# EasyEDA Pro project ProPrj_stmf4+esp32s3转接板_2025-01-29.epro, board PCB1
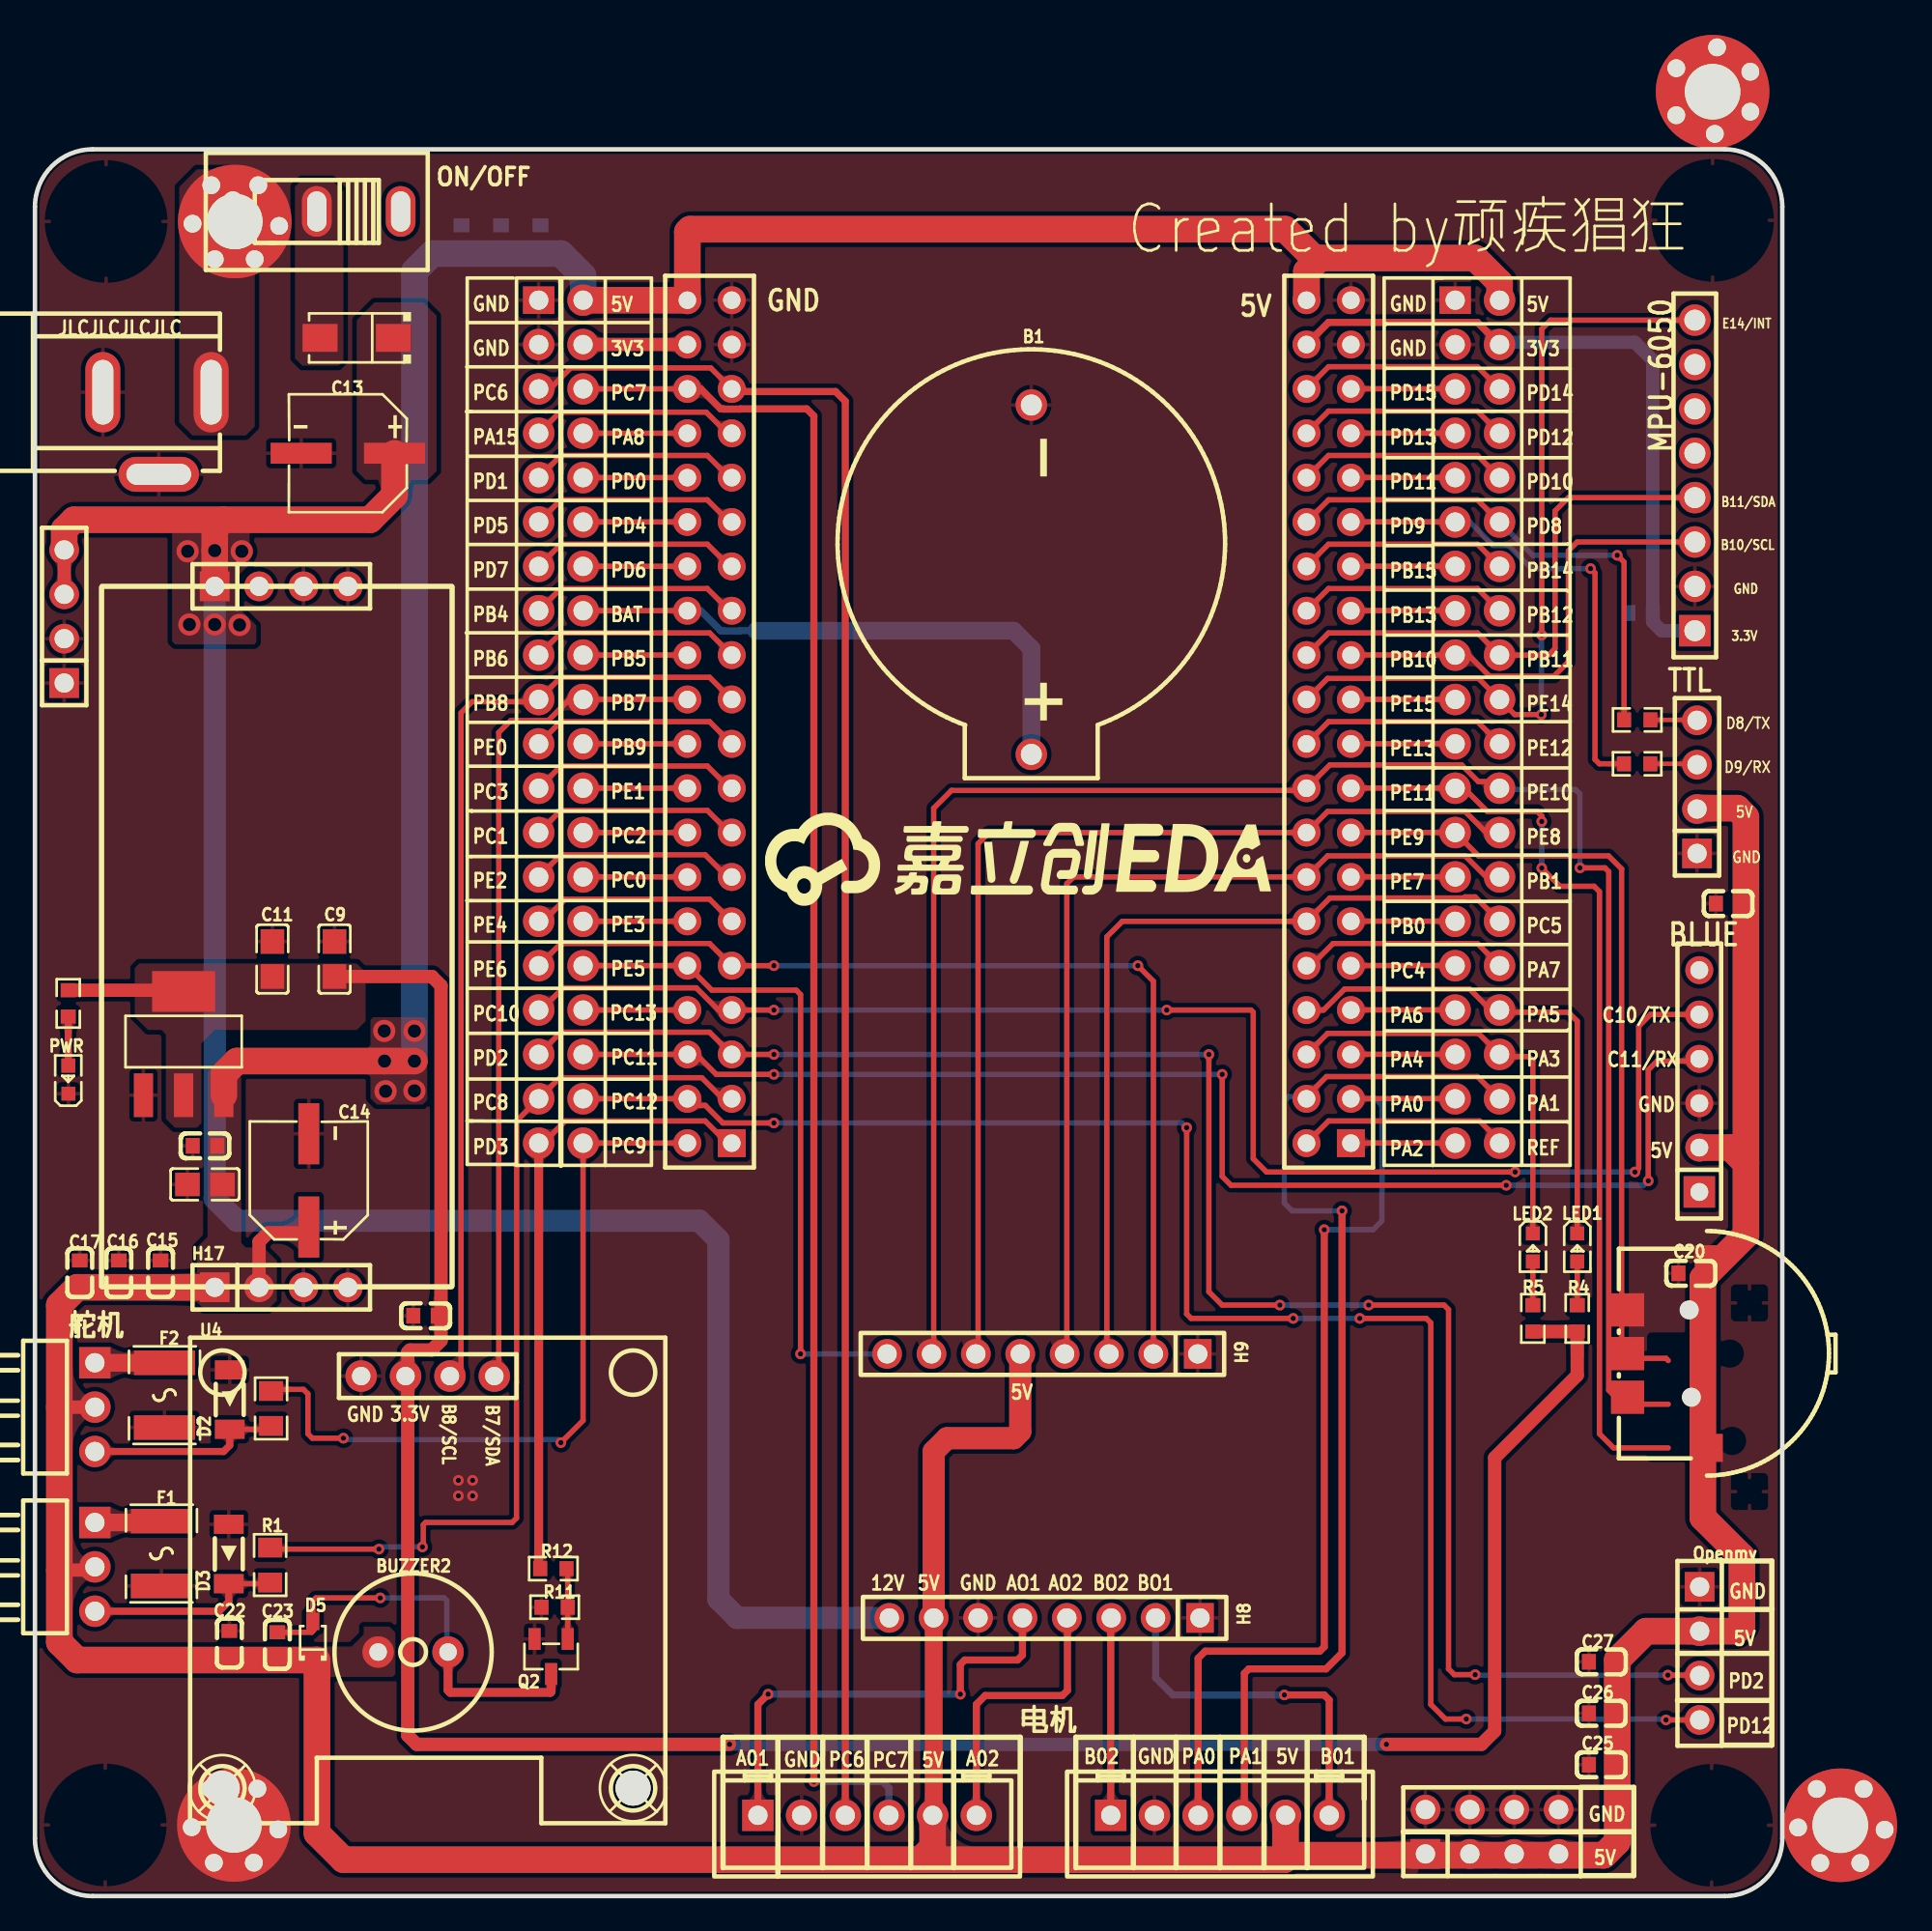
[diagram p2: board, top side]
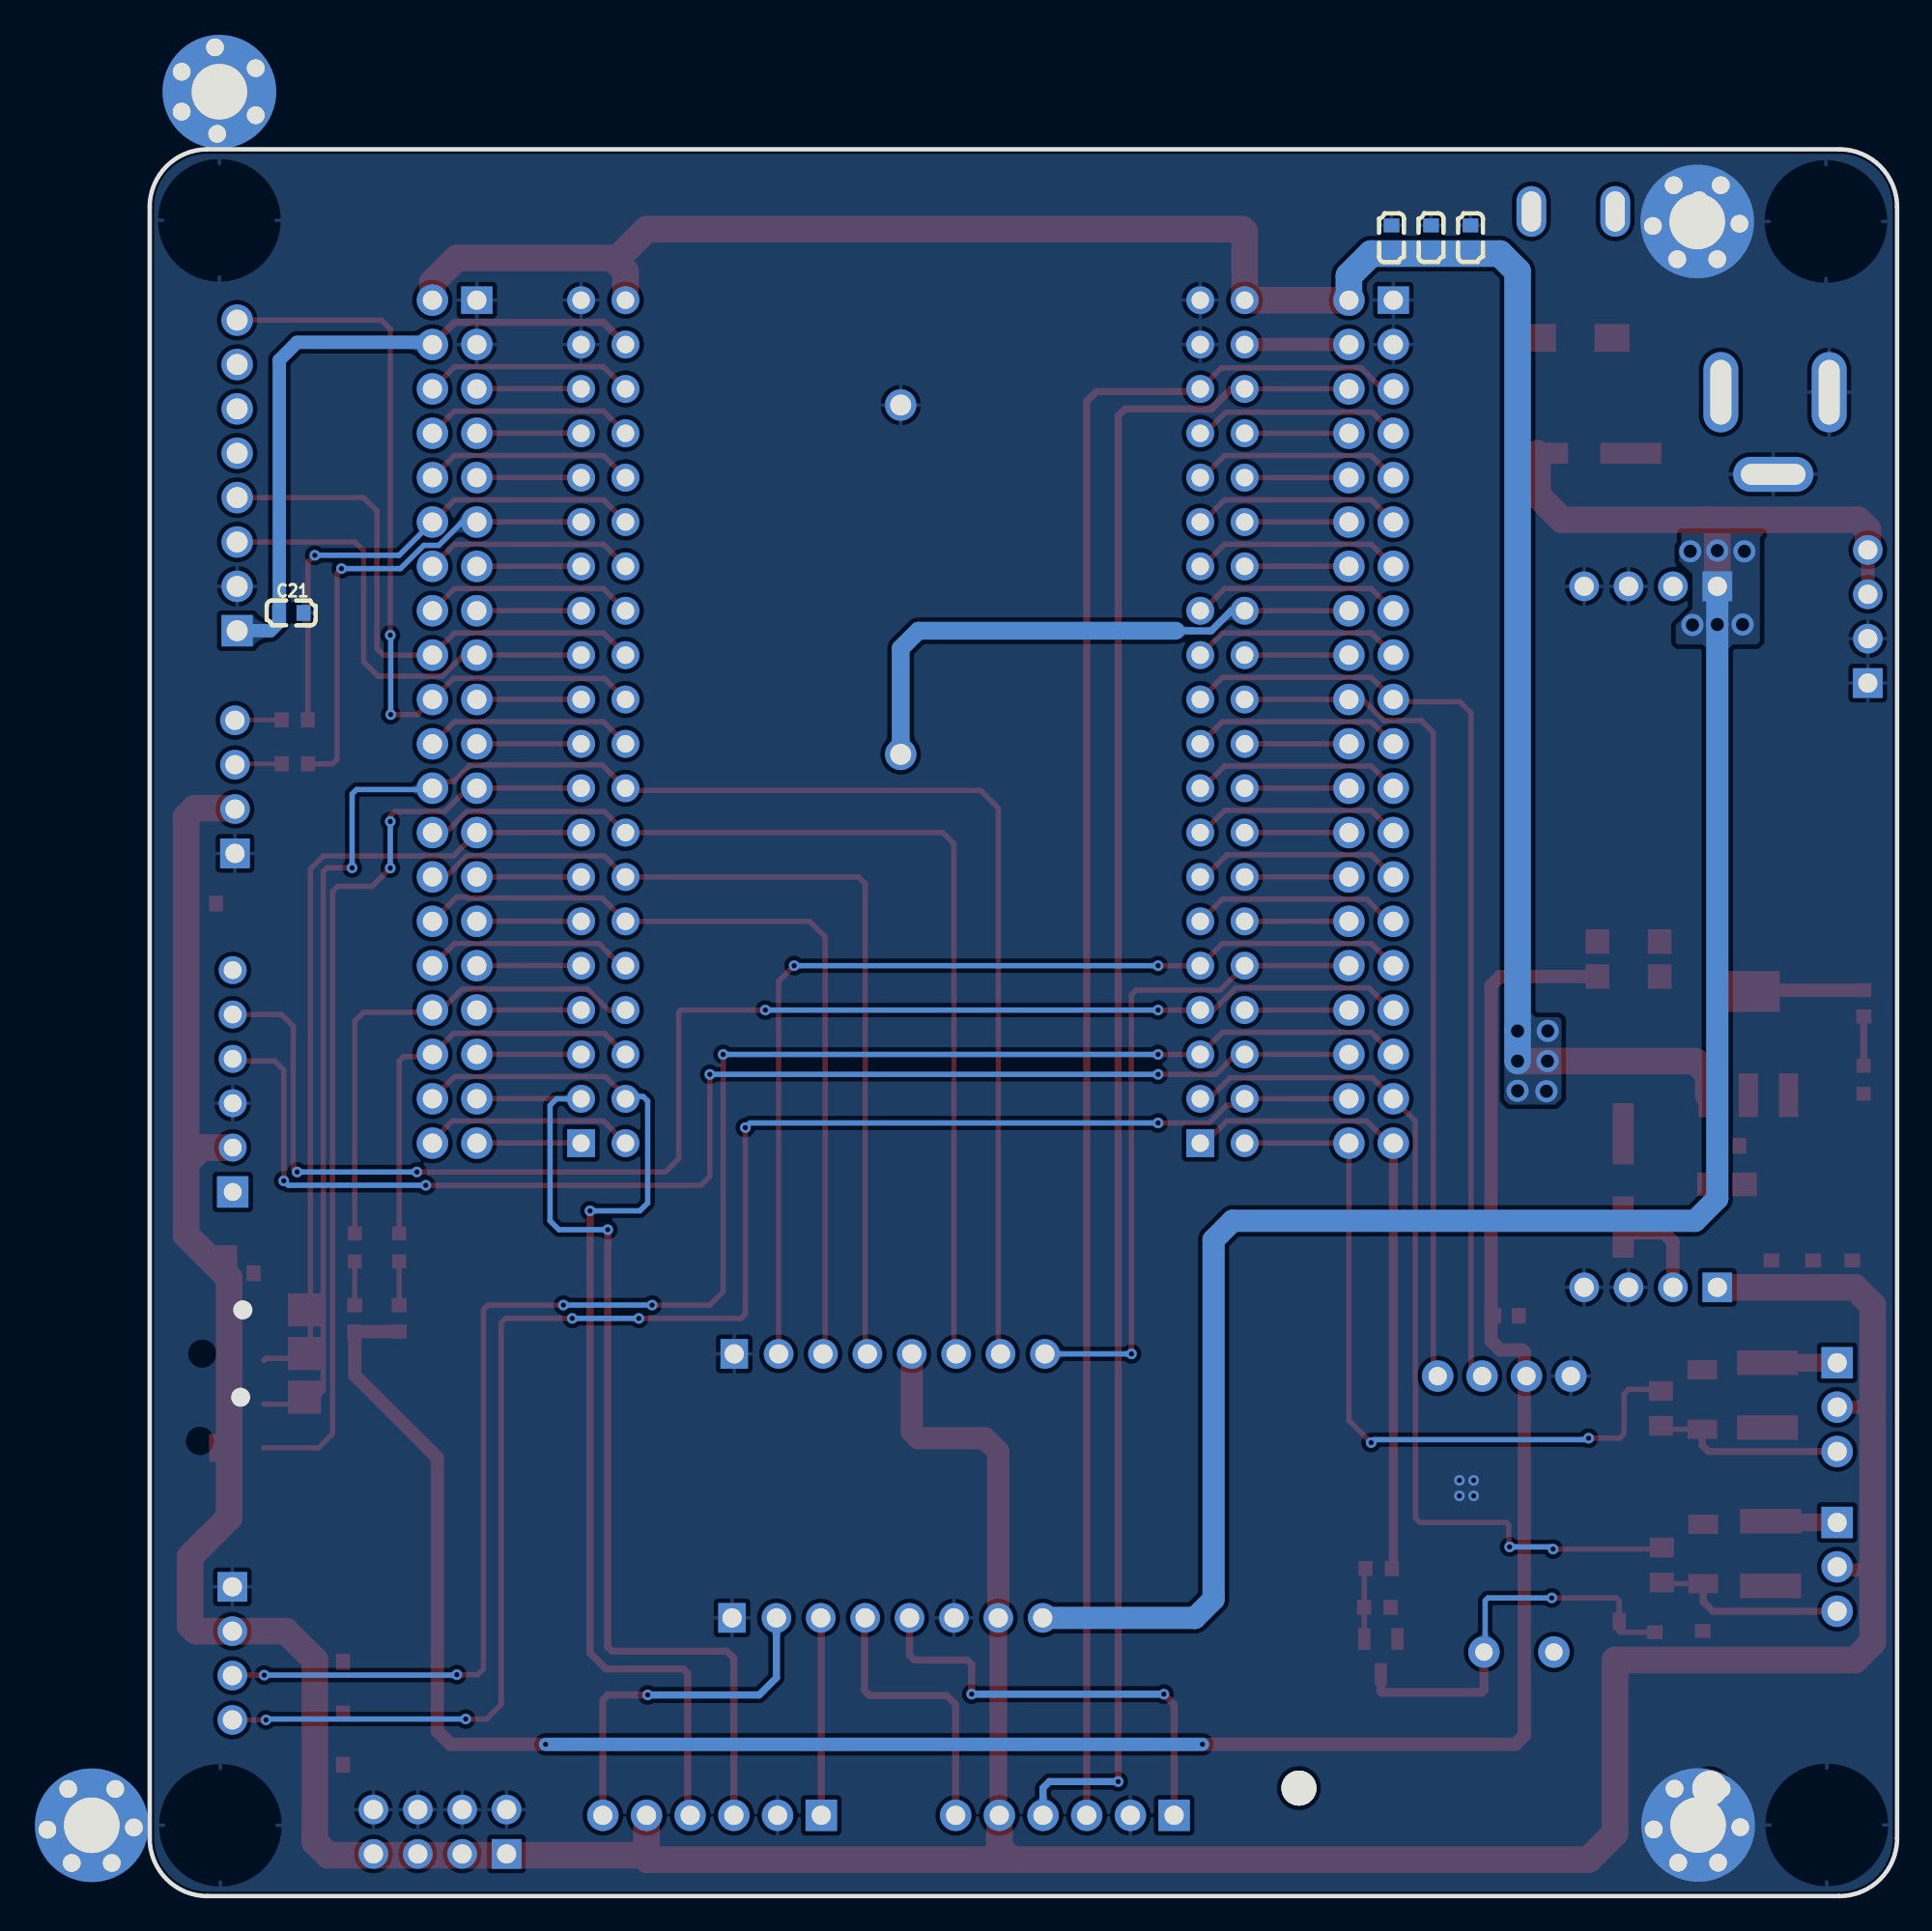
[diagram p3: board, bottom side, seen from below]

Outline 100 x 100 mm; copper layers: Top Layer, Bottom Layer. Coordinates in mm from the lower left corner of the outline.
Outline path: 0,96.7 0,3.3 arc(0.97,0.97) 3.3,0 96.7,0 arc(99.03,0.97) 100,3.3 100,96.7 arc(99.03,99.03) 96.7,100 3.3,100 arc(0.97,99.03) 0,96.7
Stack: Top Layer 0.035mm / Dielectric1 1.51mm FR4 er 4.5 / Bottom Layer 0.035mm

## Design rules (mm)
template: 自定义配置
spacing copperThickness1oz (default): track to track 0.102, other pairs 0.152 to 0.3
spacing copperThickness2oz: track to track 0.203, other pairs 0.152 to 0.3
track width copperThickness1oz (default): min 0.254, default 0.305, max 2.54
track width PWR: min 0.762, default 0.762, max 2.54
differential pair differentialPair (default): width min 0.127, default 0.254, max 2.54; gap min 0.152, default 0.152
via viaSize (default): diameter min 0.5, default 0.61, max 10; hole min 0.3, default 0.305, max 6.3
net 5V uses PWR
net 3.3V uses PWR
net 12V uses PWR

## Placement (name value [footprint] x y rotation side)
B1  BS-02-A1AJ010  [BAT-TH_BS-02-A1AJ010]  57.02 75.36 270 top
BUZZER2  2.7kHz  [BUZ-TH_BD9.0-P4.00-D0.6-FD]  21.64 13.97 0 top
C5  100nF  [C0603]  9.73 42.95 0 top
C8  100nF  [C0603]  96.9 56.82 180 top
C9  100nF  [C0805]  17.14 53.64 270 top
C11  10uf  [C0805]  13.59 53.64 270 top
C12  10uf  [C0805]  9.73 40.74 0 top
C13  47uF  [CAP-SMD_BD6.3-L6.6-W6.6-LS7.2-FD]  17.91 82.6 180 top
C14  47uF  [CAP-SMD_BD6.3-L6.6-W6.6-LS7.2-FD]  15.67 40.97 90 top
C15  10uF  [C0603]  7.19 35.69 90 top
C16  1uF  [C0603]  4.8 35.69 90 top
C17  100nF  [C0603]  2.57 35.69 90 top
C19  100nF  [C0603]  22.35 33.22 180 top
C20  100nF  [C0603]  94.76 35.65 180 top
C21  100nF  [C0603]  91.9 73.46 180 bottom
C22  100nF  [C0603]  11.12 14.48 270 top
C23  100nF  [C0603]  13.87 14.4 270 top
C25  10uF  [C0603]  89.63 7.52 0 top
C26  1uF  [C0603]  89.63 10.46 0 top
C27  100nF  [C0603]  89.63 13.41 180 top
C28  10uF  [C0603]  24.41 94.95 270 bottom
C29  1uF  [C0603]  26.67 94.95 270 bottom
C30  100nF  [C0603]  28.93 94.95 90 bottom
D1  SS34  [SMA_L4.3-W2.5-LS5.0-RD]  18.41 89.2 180 top
D2  ZMM3V3  [LL-34_L3.5-W1.5-RD]  11.15 28.42 90 top
D3  ZMM3V3  [LL-34_L3.5-W1.5-RD]  11.09 19.58 90 top
D5  1N4148WS-E  [SOD-323_L1.8-W1.3-LS2.5-RD]  15.9 14.55 90 top
DC  DC005  [DC-IN-TH_DC005]  6.98 83.74 0 top
F1  BSMD1812-200-30V  [F1812]  7.24 19.61 270 top
F2  BSMD1812-200-30V  [F1812]  7.41 28.68 270 top
H1  2.54-2*20  [HDR-TH_40P-P2.54-V-F-R2-C20-S2.54]  38.61 67.23 90 top
H2  2.54-2*20  [HDR-TH_40P-P2.54-V-F-R2-C20-S2.54]  74.04 67.23 90 top
H3  PZ2.54-2*20  [HDR-TH_40P-P2.54-V-M-R2-C20-S2.54]  30.1 67.23 270 top
H4  PZ2.54-2*20  [HDR-TH_40P-P2.54-V-M-R2-C20-S2.54]  82.55 67.23 270 top
H5  -  [HDR-TH_8P-P2.54-V-F-1]  95 81.33 90 top
H6  PZ254V-11-04P  [HDR-TH_4P-P2.54-V-M]  95.12 63.5 90 top
H7  -  [HDR-TH_6P-P2.54-V-F]  95.25 46.66 90 top
H8  PM254-1-08-Z-8.5  [HDR-TH_8P-P2.54-V-F]  57.78 15.93 180 top
H9  PM254-1-08-Z-8.5  [HDR-TH_8P-P2.54-V-F]  57.66 31.04 180 top
H10  B6B-XH-A(LF)(SN)  [CONN-TH_6P-P2.50_B6B-XH-A-LF-SN]  67.82 4.62 0 top
H11  B6B-XH-A(LF)(SN)  [CONN-TH_6P-P2.50_B6B-XH-A-LF-SN]  47.62 4.62 0 top
H14  PZ254V-12-8P  [HDR-TH_8P-P2.54-V-M-R2-C4-S2.54]  83.39 3.68 0 top
H15  PZ254V-11-04P  [HDR-TH_4P-P2.54-V-M]  1.67 73.25 90 top
H16  PZ254V-11-04P  [HDR-TH_4P-P2.54-V-M]  14.1 74.98 0 top
H17  PZ254V-11-04P  [HDR-TH_4P-P2.54-V-M]  14.1 34.85 0 top
K1  -  [125 X 300]  4.07 95.87 0 top
K2  -  [125 X 300]  96.01 95.94 90 top
K3  -  [125 X 300]  4.02 4.07 0 top
K4  -  [125 X 300]  95.95 4.05 0 top
LED1  NCD0603B1  [LED0603-RD]  88.27 37.13 270 top
LED2  NCD0603B1  [LED0603-RD]  85.73 37.13 270 top
ON/OFF  SS12D10G5  [SW-TH_SHOU-HAN_SS12D10G4]  16.13 96.44 180 top
Openmv  PM254-1-04-Z-8.5  [HDR-TH_4P-P2.54-V-F]  95.27 13.89 270 top
PWR  -  [LED_0603]  1.91 46.79 90 top
Q2  SS8050  [SOT-23-3_L2.9-W1.3-P1.90-LS2.4-BR]  29.54 13.72 90 top
R1  1kΩ  [R0805]  13.46 18.95 90 top
R2  1kΩ  [R0805]  13.51 27.92 90 top
R3  3.3kΩ  [R0603]  1.91 51.1 90 top
R4  3.3kΩ  [R0603]  88.27 33.07 90 top
R5  3.3kΩ  [R0603]  85.73 33.07 90 top
R7  47Ω  [R0603]  91.69 64.82 0 top
R8  47Ω  [R0603]  91.7 67.34 0 top
R11  10K  [R0603]  29.74 16.54 0 top
R12  1K  [R0603]  29.67 18.75 180 top
S1  PZ254R-11-03P  [HDR-TH_3P-P2.54-H-M-W10.4]  3.43 18.85 270 top
S2  PZ254R-11-03P  [HDR-TH_3P-P2.54-H-M-W10.4]  3.43 27.99 270 top
TP1  -  [M2螺丝]  34.23 6.18 0 top
TP2  -  [M2螺丝]  10.72 6.17 0 top
U2  AMS1117-3.3  [SOT-223-3_L6.5-W3.4-P2.30-LS7.0-BR]  8.51 48.82 270 top
U3  QS-301-AGS5P  [SW-SMD_QS-301-AGS5P]  93.47 31.06 270 top
U4  HS96L03W2C03  [OLED-TH_L27.8-W27.2-P2.54_C9900033791]  22.48 29.77 0 top

## Footprints (pads in the part's own frame, mm; a bottom-side part is the same pattern mirrored in y, then rotated)
125 X 300
  round 1.016 hole 1.021x1.016: 1(4.95,-0.127) 1(6.017,2.078) 1(6.22,-2.159) 1(8.506,-2.159) 1(8.71,2.078) 1(9.903,-0.254)
  round 6.5 hole 3.18x3.175: 1(7.363,0)
BAT-TH_BS-02-A1AJ010
  round 1.8 hole 1.2: 1(-10,0) 2(10,0)
BUZ-TH_BD9.0-P4.00-D0.6-FD
  round 1.8 hole 1: 1(-2,0) 2(2,0)
C0603
  rect 0.8x0.9 smd: 1(-0.7,0) 2(0.7,0)
C0805
  rect 1.41x1.35 smd: 1(-1,0) 2(1,0)
CAP-SMD_BD6.3-L6.6-W6.6-LS7.2-FD
  rect 3.5x1.2 smd: 1(-2.67,0) 2(2.67,0)
CONN-TH_6P-P2.50_B6B-XH-A-LF-SN
  rect 1.8x1.8 hole 1.1: 1(-6.251,0.001)
  round 1.8 hole 1.1: 2(-3.749,-0.001) 3(-1.249,-0.001) 4(1.251,-0.001) 5(3.751,-0.001) 6(6.251,-0.001)
DC-IN-TH_DC005
  oval 2x4.6 hole 1.2x3.7: 1(3.1,2.35) 2(-3.1,2.35)
  oval 4.6x2 hole 3.7x1.2: 3(0.1,-2.35)
F1812
  rect 1.407x3.499 smd: 1(-1.853,0) 2(1.853,0)
HDR-TH_3P-P2.54-H-M-W10.4
  rect 1.8x1.8 hole 1.1: 1(-2.54,0)
  round 1.8 hole 1.1: 2(0,0) 3(2.54,0)
HDR-TH_4P-P2.54-V-F
  rect 1.7x1.7 hole 1.1: 1(-3.81,0)
  round 1.7 hole 1.1: 2(-1.27,0) 3(1.27,0) 4(3.81,0)
HDR-TH_4P-P2.54-V-M
  rect 1.7x1.7 hole 1.1: 1(-3.81,0)
  round 1.7 hole 1.1: 2(-1.27,0) 3(1.27,0) 4(3.81,0)
HDR-TH_6P-P2.54-V-F
  rect 1.8x1.8 hole 1.02: 1(-6.35,0)
  round 1.6 hole 1.02: 2(-3.81,0) 3(-1.27,0) 4(1.27,0) 5(3.81,0) 6(6.35,0)
HDR-TH_8P-P2.54-V-F
  rect 1.575x1.7 hole 1.1: 1(-8.89,0)
  round 1.7 hole 1.1: 2(-6.35,0) 3(-3.81,0) 4(-1.27,0) 5(1.27,0) 6(3.81,0) 7(6.35,0) 8(8.89,0)
HDR-TH_8P-P2.54-V-F-1
  rect 1.8x1.8 hole 1.2: 1(-8.89,0)
  round 1.8 hole 1.2: 2(-6.35,0) 3(-3.81,0) 4(-1.27,0) 5(1.27,0) 6(3.81,0) 7(6.35,0) 8(8.89,0)
HDR-TH_8P-P2.54-V-M-R2-C4-S2.54
  rect 1.7x1.7 hole 1.1: 1(-3.81,-1.27)
  round 1.7 hole 1.1: 2(-3.81,1.27) 3(-1.27,-1.27) 4(-1.27,1.27) 5(1.27,-1.27) 6(1.27,1.27) 7(3.81,-1.27) 8(3.81,1.27)
HDR-TH_40P-P2.54-V-F-R2-C20-S2.54
  rect 1.6x1.6 hole 1: 1(-24.13,-1.27)
  round 1.6 hole 1: 2(-24.13,1.27) 3(-21.59,-1.27) 4(-21.59,1.27) 5(-19.05,-1.27) 6(-19.05,1.27) 7(-16.51,-1.27) 8(-16.51,1.27) 9(-13.97,-1.27) 10(-13.97,1.27) 11(-11.43,-1.27) 12(-11.43,1.27) 13(-8.89,-1.27) 14(-8.89,1.27) 15(-6.35,-1.27) 16(-6.35,1.27) 17(-3.81,-1.27) 18(-3.81,1.27) 19(-1.27,-1.27) 20(-1.27,1.27) 21(1.27,-1.27) 22(1.27,1.27) 23(3.81,-1.27) 24(3.81,1.27) 25(6.35,-1.27) 26(6.35,1.27) 27(8.89,-1.27) 28(8.89,1.27) 29(11.43,-1.27) 30(11.43,1.27) 31(13.97,-1.27) 32(13.97,1.27) 33(16.51,-1.27) 34(16.51,1.27) 35(19.05,-1.27) 36(19.05,1.27) 37(21.59,-1.27) 38(21.59,1.27) 39(24.13,-1.27) 40(24.13,1.27)
HDR-TH_40P-P2.54-V-M-R2-C20-S2.54
  rect 1.575x1.8 hole 1.1: 1(-24.13,-1.27)
  round 1.8 hole 1.1: 2(-24.13,1.27) 3(-21.59,-1.27) 4(-21.59,1.27) 5(-19.05,-1.27) 6(-19.05,1.27) 7(-16.51,-1.27) 8(-16.51,1.27) 9(-13.97,-1.27) 10(-13.97,1.27) 11(-11.43,-1.27) 12(-11.43,1.27) 13(-8.89,-1.27) 14(-8.89,1.27) 15(-6.35,-1.27) 16(-6.35,1.27) 17(-3.81,-1.27) 18(-3.81,1.27) 19(-1.27,-1.27) 20(-1.27,1.27) 21(1.27,-1.27) 22(1.27,1.27) 23(3.81,-1.27) 24(3.81,1.27) 25(6.35,-1.27) 26(6.35,1.27) 27(8.89,-1.27) 28(8.89,1.27) 29(11.43,-1.27) 30(11.43,1.27) 31(13.97,-1.27) 32(13.97,1.27) 33(16.51,-1.27) 34(16.51,1.27) 35(19.05,-1.27) 36(19.05,1.27) 37(21.59,-1.27) 38(21.59,1.27) 39(24.13,-1.27) 40(24.13,1.27)
LED0603-RD
  rect 0.8x0.8 smd: 1(-0.799,0) 2(0.799,0)
LED_0603
  rect 0.8x0.8 smd: 1(-0.851,-0.01) 2(0.75,-0.005)
LL-34_L3.5-W1.5-RD
  rect 1.1x1.7 smd: 1(-1.7,0) 2(1.7,0)
M2螺丝
  round 2 hole 2: 1(0,0)
OLED-TH_L27.8-W27.2-P2.54_C9900033791
  round 1.8 hole 1.05: 1(-3.81,0) 2(-1.27,0) 3(1.27,0) 4(3.81,0)
R0603
  rect 0.806x0.864 smd: 1(-0.753,0) 2(0.753,0)
R0805
  rect 1.133x1.377 smd: 1(-1,0) 2(1,0)
SMA_L4.3-W2.5-LS5.0-RD
  rect 2x1.593 smd: 1(-2.1,0) 2(2.1,0)
SOD-323_L1.8-W1.3-LS2.5-RD
  rect 1x0.75 smd: 1(-1.173,0) 2(1.173,0)
SOT-23-3_L2.9-W1.3-P1.90-LS2.4-BR
  rect 1.25x0.7 smd: 1(1,-0.95) 2(1,0.95) 3(-1,0)
SOT-223-3_L6.5-W3.4-P2.30-LS7.0-BR
  rect 2.5x1.1 smd: 1(2.97,-2.3) 2(2.97,0) 3(2.97,2.3)
  rect 2.34x3.6 smd: 4(-2.97,0)
SW-SMD_QS-301-AGS5P
  rect 1.9x1.9 smd: 1(-2.5,-2.325) 2(0,-2.325) 3(2.5,-2.325)
  rect 1.6x1.6 smd: 4(5.4,2.325) 5(-5.4,2.325)
SW-TH_SHOU-HAN_SS12D10G4
  oval 1.7x2.9 hole 1.1x2.3: 1(-4.8,0) 2(0,0) 3(4.8,0)

## Nets
As in the schematic.

Pads without a net: H5 5 6 7; H7 1 6; H16 2; ON/OFF 1; TP1 1; TP2 1

## Via types
v1: diameter 1.27, hole 0.762, Top Layer to Bottom Layer, 12 vias
v2: diameter 0.61, hole 0.305, Top Layer to Bottom Layer, 47 vias

## Routing (per net, layer and track width the routed paths; a pad name or vN(x,y) marks a point on that pad's centre or on a via; arc(x,y) is an arc through that point)
3.3V: length 192.4
  Top Layer w0.406: 72.77,88.83 74.03,90.09 82.55,90.09 83.82,88.83
  Top Layer w0.762: v2(39.75,8.69) 21.84,8.69 21.34,9.19 21.34,31.13 21.46,31.26 22.7,31.26 23.24,31.8 23.24,52.12 22.72,52.64 C9.2 ; U2.4 8.44,51.86 R3.2 ; v2(77.34,8.69) 82.78,8.69 83.54,9.45 83.54,25.1 88.27,29.82 R4.1 R5.1 ; 37.34,88.82 37.33,88.83 31.37,88.83
  Bottom Layer w0.762: 83.82,88.82 83.95,88.95 91.57,88.95 92.58,87.93 92.58,72.95 93.09,72.44 H5.1 ; v2(39.75,8.69) v2(77.34,8.69)
5V: length 379.2
  Top Layer w0.762: C14.1 15.34,37.97 13.33,37.97 12.83,37.46 H17.2 ; 1.14,28.24 1.4,27.99 S2.2 ; 1.4,18.66 3.25,18.66 S1.2
  Top Layer w1.016: H11.5 51.43,4.68 H8.7
  Top Layer w1.27: H9.5 56.39,26.59 56.01,26.21 52.2,26.21 51.43,25.45 H8.7
  Top Layer w1.524: H3.2 37.34,91.36 37.34,95.28 37.49,95.43 71.55,95.43 73.37,93.61 ; H11.5 51.38,2.79 50.67,2.08 ; 97.92,41.96 97.03,42.85 95.25,42.85 ; 97.92,41.96 97.92,61.77 97.41,62.28 95.17,62.28 H6.2 ; 97.92,41.96 97.92,37.85 95.45,35.38 95.45,21.67 97.69,19.43 97.69,15.49 97.36,15.16 Openmv.2 92.2,15.16 90.55,13.51 90.55,3.1 89.79,2.34 71.75,2.34 71.5,2.08 ; 71.5,2.08 71.5,2.4 71.57,2.47 H10.5 ; 71.5,2.08 50.67,2.08 ; H17.1 2.41,34.85 1.4,33.83 1.4,14.53 2.41,13.51 16.14,13.51 16.14,3.6 17.65,2.08 50.67,2.08 ; 73.37,93.61 73.53,93.78 82.42,93.78 83.82,92.38 H4.2 ; 73.37,93.61 72.77,93.01 H2.40 ; U2.3 10.81,47.05 11.56,47.8 v1(20,47.8) v1(21.72,47.8)
  Bottom Layer w1.524: H3.2 31.37,92.76 30.1,94.03 22.73,94.03 21.72,93.01 v1(21.72,49.53) v1(21.72,47.8)
  vias: v1(19.99,49.53) v1(20.07,46.08) v1(21.72,46.1)
12V: length 125.5
  Top Layer w0.762: H15.3 H15.4
  Top Layer w1.524: H16.1 v1(10.29,77.03) 10.29,78.28 10.8,78.79 ; H15.4 1.67,78.23 2.23,78.79 10.8,78.79 ; 10.8,78.79 19.18,78.79 20.58,80.19 C13.1
  Bottom Layer w1.27: H16.1 v1(10.29,72.8) 10.29,39.93 11.56,38.66 38.02,38.66 39.12,37.57 39.12,16.99 40.18,15.93 H8.8
  vias: v1(8.74,76.99) v1(8.84,72.8) v1(11.71,72.77) v1(11.84,76.99)
GND:
  vias: v2(24.23,23.8) v2(24.23,22.91) v2(25.05,23.8) v2(25.05,22.91)
AO1: length 25.8
  Top Layer w0.406: v2(41.96,11.56) 41.37,10.97 H11.1 ; v2(52.96,11.56) 52.96,13.26 53.21,13.51 56.23,13.51 56.52,13.8 H8.5
  Bottom Layer w0.406: v2(52.96,11.56) v2(41.96,11.56)
AO2: length 16.1
  Top Layer w0.406: H8.4 59.09,15.89 59.09,11.77 58.8,11.48 54.38,11.48 53.88,10.97 H11.6
BAT: length 32.6
  Top Layer w0.305: 31.37,73.59 37.33,73.59 37.34,73.58
  Bottom Layer w0.406: 37.34,73.58 38.1,73.58 39.24,72.44 39.39,72.44 39.4,72.43 40.36,72.43 40.37,72.44 41.27,72.44
  Bottom Layer w1.016: 41.27,72.44 56.01,72.44 57.02,71.42 B1.2
BO1: length 20.5
  Top Layer w0.406: H10.6 74.07,11.23 73.78,11.51 v2(71.5,11.51)
  Bottom Layer w0.406: H8.2 64.14,12.5 65.12,11.51 v2(71.5,11.51)
BO2: length 11.3
  Top Layer w0.406: H8.3 61.57,15.9 H10.1
PA0: length 58.4
  Top Layer w0.305: 81.28,45.65 81.28,45.65 75.31,45.65
  Top Layer w0.406: H10.3 66.57,13.61 66.98,14.02 73.53,14.02 73.79,14.27 v2(73.79,38.15)
  Bottom Layer w0.305: v2(73.79,38.15) 76.58,38.15 77.09,38.66 77.09,45.26 76.71,45.64 H2.3
PA1: length 62.5
  Top Layer w0.305: 72.77,45.65 72.77,45.77 73.91,46.91 82.55,46.91 83.82,45.65
  Top Layer w0.406: v2(74.8,39.23) 74.8,13.92 73.89,13 69.47,13 69.21,12.75 69.21,4.77 H10.4
  Bottom Layer w0.305: H2.4 72.64,45.77 71.75,45.77 71.5,45.52 71.5,39.67 71.95,39.23 v2(74.8,39.23)
PA2: length 6
  Top Layer w0.305: 75.31,43.11 81.28,43.11 81.28,43.11
PA3: length 24
  Top Layer w0.305: LED2.1 85.73,47.8 85.47,48.06 83.95,48.06 82.62,49.39 73.98,49.39 72.77,48.18
PA4: length 6
  Top Layer w0.305: 75.31,48.19 81.28,48.19 81.28,48.19
PA5: length 28.9
  Top Layer w0.305: LED1.1 88.27,50.09 87.76,50.6 83.95,50.6 H4.34 83.31,50.72 82.11,51.93 74.95,51.93 73.75,50.72 H2.8
PA6: length 6
  Top Layer w0.305: 75.31,50.73 81.28,50.73 81.28,50.73
PA7: length 12.1
  Top Layer w0.305: 83.82,53.27 82.55,54.53 74.3,54.53 73.03,53.27 72.77,53.27
PA8: length 6
  Top Layer w0.305: 31.37,83.75 37.33,83.75 37.34,83.74
PA15: length 12
  Top Layer w0.305: 39.88,83.74 39.62,83.74 38.42,84.95 30.03,84.95 28.83,83.75
PB0: length 6
  Top Layer w0.305: 81.28,55.81 81.28,55.81 75.31,55.81
PB1: length 52.9
  Top Layer w0.305: 58.93,31.04 59.05,31.17 59.05,57.96 59.44,58.34 H2.14 73.98,59.55 81.85,59.55 83.06,58.34 H4.28
PB4: length 12.1
  Top Layer w0.305: 28.83,73.59 30.09,74.85 38.48,74.85 39.75,73.58 H1.25
PB5: length 6
  Top Layer w0.305: 31.37,71.05 37.33,71.05 37.34,71.04
PB6: length 12.1
  Top Layer w0.305: 28.83,71.05 30.09,72.31 38.61,72.31 39.88,71.04
PB7: length 48.5
  Top Layer w0.305: 26.92,29.9 26.54,30.28 26.54,66.61 27.23,67.3 29.38,67.3 30.58,68.5 H3.20 ; 31.37,68.51 37.33,68.51 37.34,68.5
PB8: length 54.7
  Top Layer w0.305: H3.19 28.7,68.38 25.02,68.38 24.38,67.74 24.38,29.9 ; H1.21 38.61,69.77 30.09,69.77 28.83,68.51
PB9: length 6
  Top Layer w0.305: 31.37,65.97 37.33,65.97 37.34,65.96
PB10: length 27.3
  Top Layer w0.305: 81.28,71.05 81.28,71.05 75.31,71.05 ; 95.25,77.52 88.27,77.52 87.76,77.01 87.76,70.66 86.93,69.84 83.25,69.84 82.04,71.04 81.28,71.04
PB11: length 31.9
  Top Layer w0.305: 83.82,71.04 83.82,71.04 ; 83.82,71.04 82.55,72.31 74.03,72.31 72.77,71.05 ; 83.82,71.04 86.61,71.04 86.99,71.42 86.99,79.3 87.76,80.06 95.25,80.06
PB12: length 12.1
  Top Layer w0.305: 72.77,73.59 74.03,74.85 82.55,74.85 83.82,73.59
PB13: length 6
  Top Layer w0.305: 81.28,73.59 81.28,73.59 75.31,73.59
PB14: length 12.1
  Top Layer w0.305: 72.77,76.13 74.03,77.39 82.55,77.39 83.82,76.13
PB15: length 6
  Top Layer w0.305: 81.28,76.13 81.28,76.13 75.31,76.13
PC0: length 6
  Top Layer w0.305: 37.34,58.34 37.33,58.35 31.37,58.35
PC1: length 12.1
  Top Layer w0.305: 39.88,60.88 39.75,60.88 38.48,62.15 30.09,62.15 28.83,60.89
PC2: length 6
  Top Layer w0.305: 31.37,60.89 37.33,60.89 37.34,60.88
PC3: length 12.1
  Top Layer w0.305: 28.83,63.43 30.09,64.69 38.48,64.69 39.75,63.42 H1.17
PC4: length 6
  Top Layer w0.305: 75.31,53.27 81.28,53.27 81.28,53.27
PC5: length 47.9
  Top Layer w0.305: H9.3 61.34,31.17 61.34,54.91 62.23,55.8 72.77,55.8 74.11,57.14 81.78,57.14 81.84,57.2 82.42,57.2 83.82,55.8
PC6: length 99.8
  Top Layer w0.305: 28.83,86.28 29.46,86.28 30.67,87.49 38.67,87.49 39.88,86.28
  Top Layer w0.406: 39.88,86.28 40.49,86.28 40.64,86.13 45.82,86.13 46.38,85.58 H11.3
PC7: length 98.1
  Top Layer w0.305: 37.34,86.28 37.33,86.29 31.37,86.29
  Top Layer w0.406: v2(44.58,6.55) 44.58,84.73 44.17,85.14 40.37,85.14 40.36,85.13 39.4,85.13 39.39,85.14 39.24,85.14 38.1,86.28 37.34,86.28
  Bottom Layer w0.406: v2(44.58,6.55) 48.51,6.55 48.88,6.19 H11.4
PC8: length 51.9
  Top Layer w0.305: v2(22.17,19.99) 22.22,20.04 22.22,21.26 22.35,21.39 27.3,21.39 27.56,21.64 27.56,29.41 27.57,29.42 27.57,44.39 H3.37 ; v2(19.69,19.86) 13.8,19.86 13.71,19.95 ; H1.3 39.37,45.64 38.17,46.85 30.03,46.85 28.83,45.65
  Bottom Layer w0.305: v2(22.17,19.99) 19.81,19.99 v2(19.69,19.86)
PC9: length 42.6
  Top Layer w0.305: 37.34,43.1 37.33,43.11 31.37,43.11 ; 13.77,28.92 13.86,29.01 15.37,29.01 15.62,28.75 15.62,26.47 15.88,26.21 v2(17.65,26.21) ; v2(30.1,25.96) 31.37,27.23 31.37,43.1
  Bottom Layer w0.305: v2(17.65,26.21) 17.74,26.13 29.93,26.13 v2(30.1,25.96)
PC10: length 84.7
  Top Layer w0.305: v2(64.77,50.72) 69.6,50.72 69.72,50.6 69.72,42.21 70.48,41.45 v2(84.71,41.45) ; H7.5 92.46,50.47 91.78,49.8 91.78,41.67 v2(91.57,41.45) ; 28.83,50.73 28.96,50.73 30.23,51.99 37.85,51.99 39.12,50.72 H1.7 v2(42.29,50.72)
  Bottom Layer w0.305: v2(84.71,41.45) v2(91.57,41.45) ; v2(42.29,50.72) v2(64.77,50.72)
PC11: length 77.1
  Top Layer w0.305: v2(67.95,47.04) 67.95,41.2 68.45,40.69 v2(84.2,40.69) ; v2(92.33,40.94) 92.33,47.29 92.84,47.8 95.12,47.8 95.25,47.93 ; v2(42.29,47.04) 38.99,47.04 37.85,48.18 37.34,48.18 37.33,48.19 31.37,48.19
  Bottom Layer w0.305: v2(84.2,40.69) 92.08,40.69 v2(92.33,40.94) ; v2(67.95,47.04) v2(42.29,47.04)
PC12: length 97.7
  Top Layer w0.305: Openmv.4 v2(93.34,10.08) ; v2(72.01,33.07) 66.17,33.07 65.91,33.32 v2(65.91,43.99) ; 37.34,45.64 37.72,45.26 38.37,45.26 39.37,44.26 v2(42.29,44.26) ; v2(81.92,10.13) 80.72,10.13 79.88,10.97 79.88,32.82 79.63,33.07 v2(75.82,33.07) ; 31.37,45.65 37.33,45.65
  Bottom Layer w0.305: v2(42.29,44.26) 65.65,44.26 v2(65.91,43.99) ; v2(72.01,33.07) v2(75.82,33.07) ; v2(93.34,10.08) 93.29,10.13 v2(81.92,10.13)
PC13: length 6
  Top Layer w0.305: 31.37,50.73 37.33,50.73 37.34,50.72
PD0: length 6
  Top Layer w0.305: 31.37,81.21 37.33,81.21 37.34,81.2
PD1: length 12.1
  Top Layer w0.305: H1.31 39.75,81.2 38.48,82.47 30.09,82.47 28.83,81.21
PD2: length 102.2
  Top Layer w0.305: Openmv.3 95.24,12.65 v2(93.45,12.65) ; v2(67.18,48.18) 67.18,34.59 67.95,33.83 v2(71.25,33.83) ; v2(42.29,48.18) 39.88,48.18 38.61,49.45 30.09,49.45 28.83,48.19 ; v2(76.33,33.83) 80.64,33.83 80.9,33.58 80.9,13 81.23,12.67 v2(82.42,12.67)
  Bottom Layer w0.305: v2(93.45,12.65) 82.45,12.65 v2(82.42,12.67) ; v2(67.18,48.18) v2(42.29,48.18) ; v2(76.33,33.83) v2(71.25,33.83)
PD3: length 36.6
  Top Layer w0.305: 28.83,43.11 29.09,43.11 30.35,44.37 38.36,44.37 39.62,43.1 39.88,43.1
  Top Layer w0.508: 28.83,43.1 28.83,18.59
PD4: length 6
  Top Layer w0.305: 31.37,78.67 37.33,78.67 37.34,78.66
PD5: length 12.1
  Top Layer w0.305: 28.83,78.67 30.09,79.93 38.48,79.93 39.75,78.66 H1.29
PD6: length 6
  Top Layer w0.305: 37.34,76.12 37.33,76.13 31.37,76.13
PD7: length 12.1
  Top Layer w0.305: 39.88,76.12 39.75,76.12 38.48,77.39 30.09,77.39 28.83,76.13
PD8: length 29.2
  Top Layer w0.305: 83.82,78.67 82.55,79.93 74.03,79.93 72.77,78.67 ; v2(90.55,76.76) 90.95,76.36 R8.1
  Bottom Layer w0.305: v2(90.55,76.76) 85.73,76.76 H4.12
PD9: length 27.6
  Top Layer w0.305: R7.1 89.53,64.82 89.28,65.07 89.28,75.74 v2(89.03,76) ; 75.31,78.67 81.28,78.67 81.28,78.67
  Bottom Layer w0.305: v2(89.03,76) 85.65,76 84.32,77.33 83.45,77.33 82.12,78.66 H4.11
PD10: length 12.1
  Top Layer w0.305: 83.82,81.21 82.55,82.47 74.03,82.47 72.77,81.21
PD11: length 6
  Top Layer w0.305: 75.31,81.21 81.28,81.21 81.28,81.21
PD12: length 12.1
  Top Layer w0.305: 83.82,83.75 82.55,85.01 74.03,85.01 72.77,83.75
PD13: length 6
  Top Layer w0.305: 75.31,83.75 81.28,83.75 81.28,83.75
PD14: length 12.1
  Top Layer w0.305: 72.77,86.29 74.03,87.55 82.55,87.55 83.82,86.29
PD15: length 6
  Top Layer w0.305: 81.28,86.29 81.28,86.29 75.31,86.29
PE0: length 12.1
  Top Layer w0.305: 28.83,65.97 30.09,67.23 38.61,67.23 39.88,65.96
PE1: length 6
  Top Layer w0.305: 31.37,63.43 37.33,63.43 37.34,63.42
PE2: length 12.1
  Top Layer w0.305: H1.13 39.62,58.34 38.35,59.61 30.09,59.61 28.83,58.35
PE3: length 6
  Top Layer w0.305: 37.34,55.8 37.33,55.81 31.37,55.81
PE4: length 12.1
  Top Layer w0.305: 28.83,55.81 29.09,55.81 30.35,57.07 38.61,57.07 39.88,55.8
PE5: length 38.7
  Top Layer w0.305: 31.37,53.27 37.33,53.27 38.73,51.87 43.56,51.87 43.81,51.61 v2(43.81,31.04)
  Bottom Layer w0.305: v2(43.81,31.04) 48.77,31.04
PE6: length 57.9
  Top Layer w0.305: H9.2 64.01,52.37 v2(63.12,53.26) ; 28.83,53.27 30.09,54.53 38.61,54.53 39.88,53.26 v2(42.29,53.26)
  Bottom Layer w0.305: v2(42.29,53.26) v2(63.12,53.26)
PE7: length 6
  Top Layer w0.305: 75.31,58.35 81.28,58.35 81.28,58.35
PE8: length 60.4
  Top Layer w0.305: H9.6 53.98,31.17 53.98,60.25 54.61,60.88 72.77,60.88 73.98,62.09 81.85,62.09 83.06,60.88 83.82,60.88
PE9: length 46.9
  Top Layer w0.305: 81.28,60.88 82.62,59.55 90.06,59.55 90.8,58.8 90.8,31.09 91.11,30.78 93.34,30.78 93.47,30.66 ; 75.31,60.89 81.28,60.89 81.28,60.89
PE10: length 109.5
  Top Layer w0.305: H9.7 51.43,31.17 51.43,62.28 52.45,63.3 72.64,63.3 H2.18 74.11,64.76 81.65,64.76 82.6,63.8 83.69,63.8 83.82,63.68 H4.24 ; v2(88.42,58.86) 89.85,58.86 90.07,58.65 90.07,28.96 90.87,28.16 93.47,28.16
  Bottom Layer w0.305: H4.24 83.9,63.35 88.16,63.35 88.42,63.09 v2(88.42,58.86)
PE11: length 53.7
  Top Layer w0.305: 93.47,25.66 90.34,25.66 89.53,26.47 89.53,57.51 89.23,57.81 87.27,57.81 v2(86.23,58.85) ; 81.28,63.43 81.28,63.43 75.31,63.43 ; v2(86.23,61.52) 86.23,61.83 85.98,62.09 83.12,62.09 81.79,63.42 H4.23
  Bottom Layer w0.305: v2(86.23,58.85) v2(86.23,61.52)
PE12: length 12.1
  Top Layer w0.305: 83.82,65.97 82.55,67.23 74.03,67.23 72.77,65.97
PE13: length 6
  Top Layer w0.305: 81.28,65.97 81.28,65.97 75.31,65.97
PE14: length 46.6
  Top Layer w0.305: H2.22 73.98,69.71 82.62,69.71 H4.20 84.68,67.64 v2(86.21,67.64) ; 95.76,90.22 86.74,90.22 86.23,89.71 v2(86.23,72.19)
  Bottom Layer w0.305: v2(86.21,67.64) 86.21,72.16 v2(86.23,72.19)
PE15: length 6
  Top Layer w0.305: 75.31,68.51 81.28,68.51 81.28,68.51
REF: length 12.2
  Top Layer w0.305: 83.82,43.11 83.82,43.23 82.68,44.37 74.03,44.37 72.77,43.11
$1N2696: length 2.5
  Top Layer w0.305: LED1.2 R4.2
$1N2700: length 2.5
  Top Layer w0.305: LED2.2 R5.2
$1N2797: length 2.8
  Top Layer w0.406: PWR.2 1.91,47.54 R3.1
$1N8258: length 2.7
  Top Layer w0.254: R7.2 95.07,64.82 H6.3
$1N8301: length 2.7
  Top Layer w0.254: H6.4 95.1,67.34 R8.2
$1N18209: length 11.5
  Top Layer w0.305: 13.77,26.92 13.58,26.72 D2.1
  Top Layer w0.406: S2.3 10.8,25.45 11.15,25.8 D2.1
$1N18213: length 4
  Top Layer w1.016: S2.1 F2.1
$1N18214: length 11.6
  Top Layer w0.305: D3.1 13.65,17.88 13.71,17.95
  Top Layer w0.406: S1.3 10.54,16.31 11.09,16.86 D3.1
$1N18218: length 3.8
  Top Layer w1.016: F1.1 7.16,21.39 S1.1
$1N23987: length 4.1
  Top Layer w0.305: R12.1 30.49,18.68 Q2.1
$1N23989: length 23.8
  Top Layer w0.305: v2(19.76,17.07) 16.08,17.07 15.9,16.89 D5.2 15.95,15.68 15.95,15.21 15.84,15.1 C23.1
  Top Layer w0.508: Q2.3 29.54,11.71 29.49,11.66 23.77,11.66 23.64,11.79 BUZZER2.2
  Bottom Layer w0.305: v2(19.76,17.07) 23.42,17.07 23.57,16.92 23.57,14.04 BUZZER2.2

## Copper pours and planes (outline as drawn; the poured copper is in the pictures)
3.3V on Top Layer: 5.71,53.39 11.3,53.39 11.3,43.99 5.71,43.99
3.3V on Top Layer: 11.05,53.39 18.92,53.39 18.92,49.58 11.05,49.58
5V on Top Layer: 19.05,50.32 22.45,50.32 22.45,45.31 19.05,45.31
5V on Top Layer: 15.9,15.43 20.62,15.43 20.62,12.47 15.9,12.47
5V on Top Layer: 9.27,47.45 13.84,47.45 13.84,33.6 9.27,33.6
5V on Bottom Layer: 19.2,50.75 22.48,50.75 22.48,45.31 19.2,45.31
12V on Top Layer: 7.85,78.03 12.67,78.03 12.67,71.65 7.85,71.65
12V on Top Layer: 18.41,91.24 22.99,91.24 22.99,81.08 18.41,81.08
12V on Bottom Layer: 7.7,78.03 12.67,78.03 12.67,71.45 7.7,71.45
GND on Top Layer: -24.35,107.56 113.91,107.56 113.91,-9.3 -24.35,-9.3
GND on Bottom Layer: -7.12,103.41 102.41,103.41 102.41,-4.15 -7.12,-4.15
$1N2806 on Top Layer: 8.25,98.86 12.58,98.86 12.58,83.62 8.25,83.62
$1N2808 on Top Layer: 14.88,98.24 17.65,98.24 17.65,87.61 14.88,87.61

Small or netless copper shapes (teardrops, artwork), in the pictures only: 308 on Top Layer, 56 on Bottom Layer

## Text on the board
Top Silkscreen Layer: 3.3V | B10/SCL | B11/SDA | E14/INT | GND | D9/RX | D8/TX | 5V | B7/SDA | B8/SCL | JLCJLCJLCJLC | PC6 | PA15 | PD1 | PD5 | PD7 | PB4 | PB6 | PB8 | PE0 | PC3 | PC1 | PE2 | PE4 | PE6 | PC10 | PD2 | PC8 | PD3 | PC13 | 3V3 | PC7 | PA8 | PD0 | PD4 | PD6 | BAT | PB5 | PB7 | PB9 | PE1 | PC2 | PC0 | PE3 | PE5 | PC11 | PC12 | PC9 | A01 | 12V | A02 | AO1 | AO2 | B02 | BO2 | BO1 | B01 | PD15 | PD13 | PD11 | PD9 | PB15 | PB13 | PB10 | PE15 | PE13 | PE11 | PE9 | PE7 | PB0 | PC4 | PA6 | PA4 | PA0 | PA2 | PD14 | PD12 | PD10 | PD8 | PB14 | PB12 | PB11 | PE14 | PE12 | PE10 | PE8 | PB1 | PC5 | PA7 | PA5 | PA3 | PA1 | REF | C10/TX | C11/RX | TTL | BLUE | MPU-6050 | 舵机 | 电机 | Created by顽疾猖狂
